# EAGLE design communication (EAGLE 9.6.2)
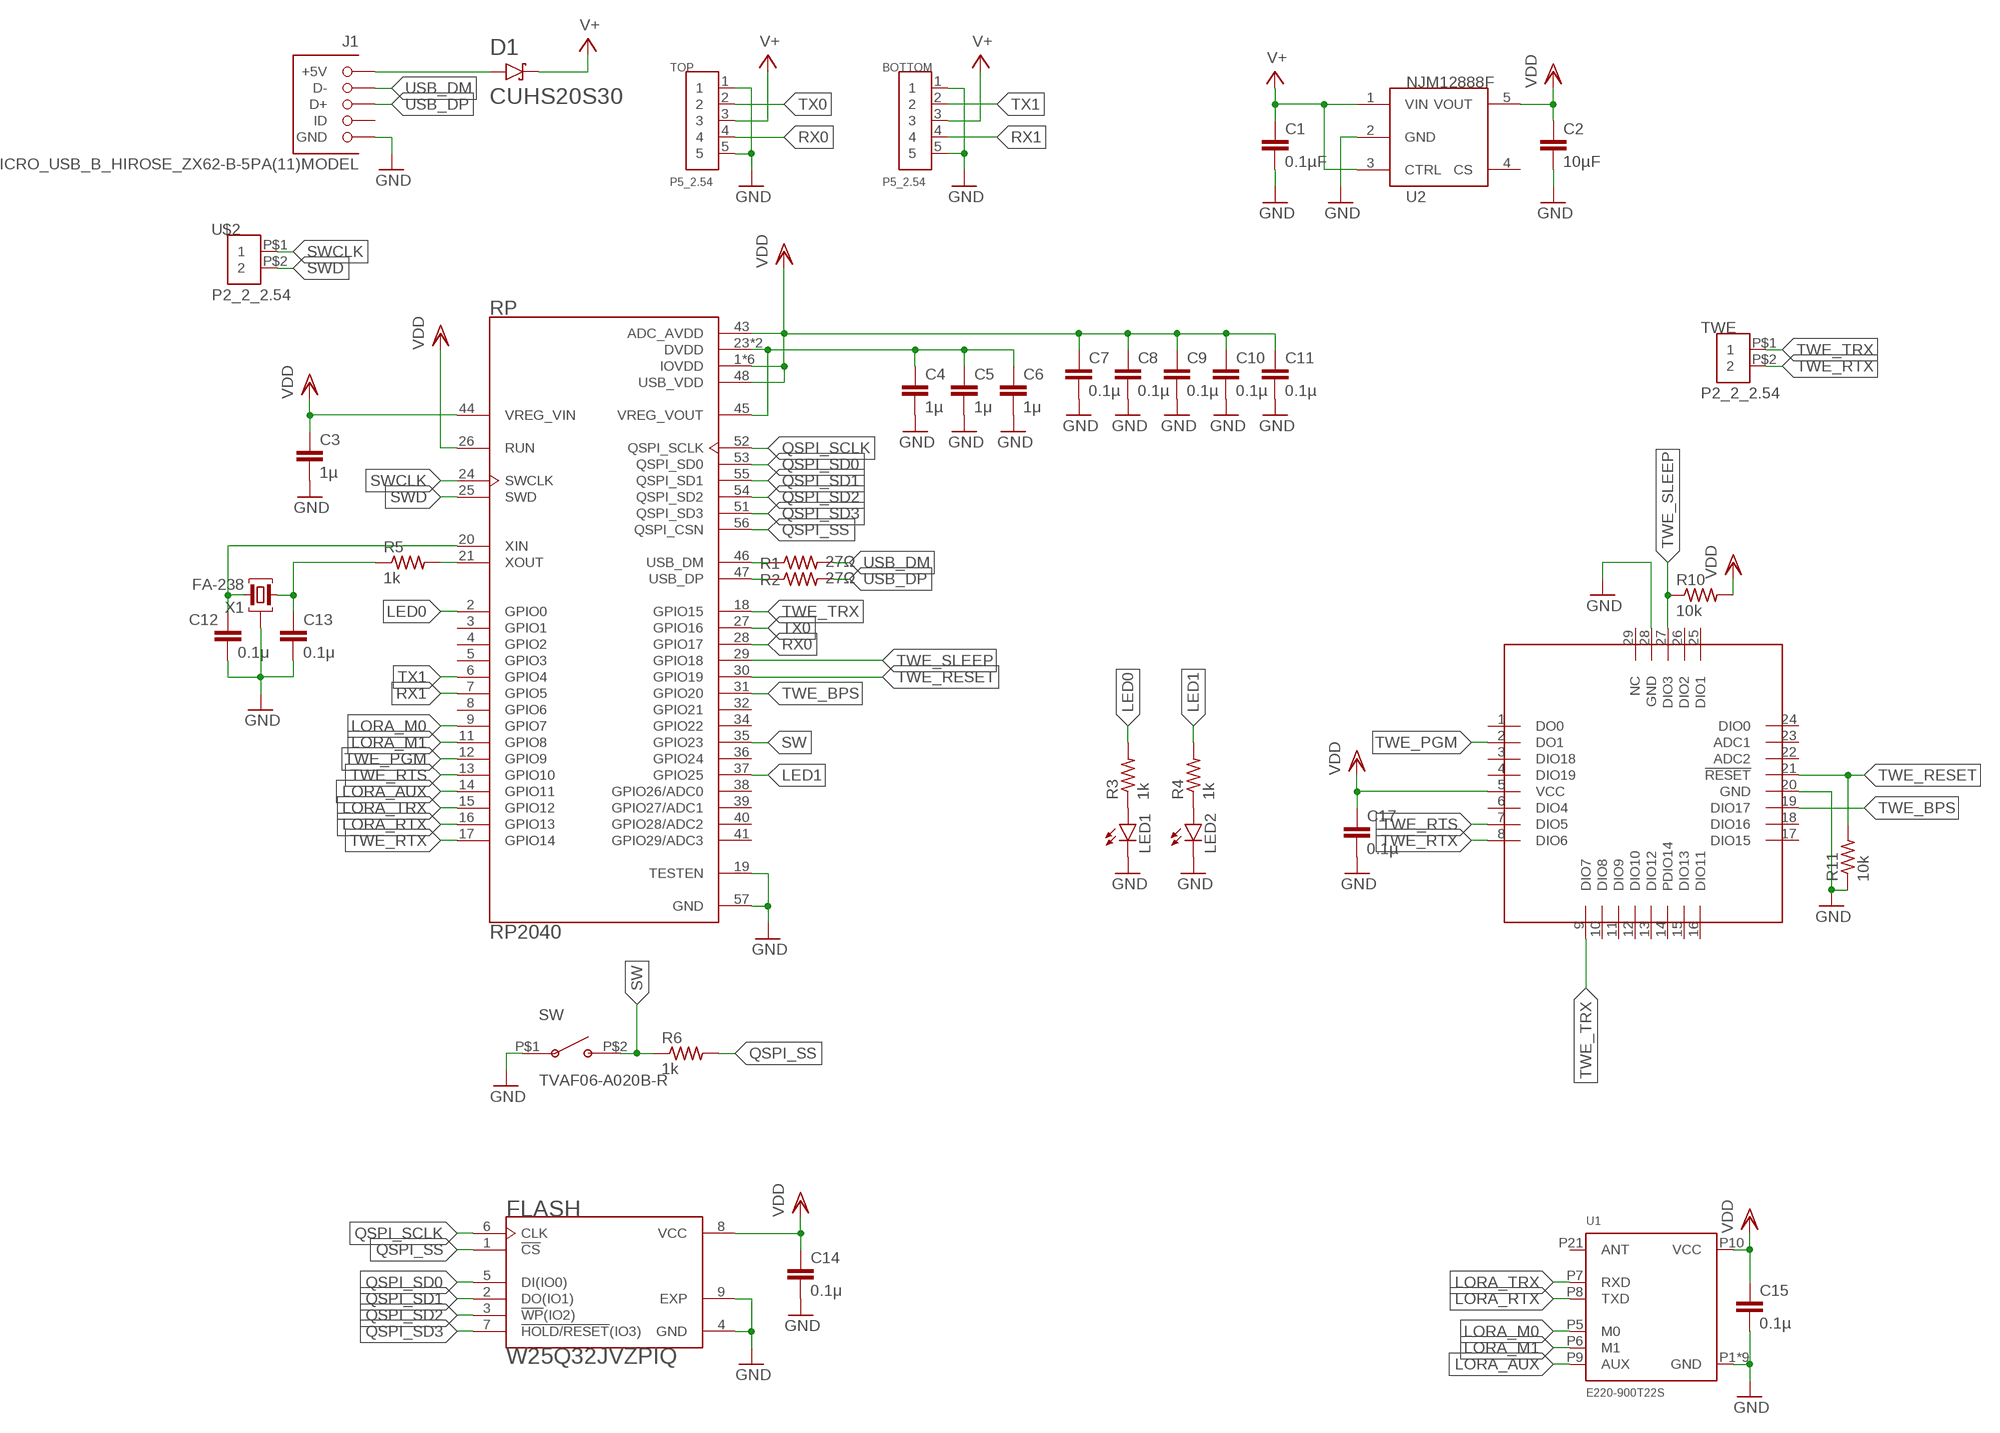
[diagram p0: schematic, sheet 1]

## Parts
BOTTOM  P5_2.54  [P5_2.54]
C1  0.1µF  C-EUC0402  [C0402]
C2  10µF  C-EUC0402  [C0402]
C3  1µ  C-EUC0402  [C0402]
C4  1µ  C-EUC0402  [C0402]
C5  1μ  C-EUC0402  [C0402]
C6  1μ  C-EUC0402  [C0402]
C7  0.1µ  C-EUC0402  [C0402]
C8  0.1µ  C-EUC0402  [C0402]
C9  0.1µ  C-EUC0402  [C0402]
C10  0.1µ  C-EUC0402  [C0402]
C11  0.1µ  C-EUC0402  [C0402]
C12  0.1μ  C-EUC0402  [C0402]
C13  0.1μ  C-EUC0402  [C0402]
C14  0.1μ  C-EUC0402  [C0402]
C15  0.1µ  C-EUC0402  [C0402]
C17  0.1µ  C-EUC0402  [C0402]
D1  CUHS20S30  [CUHS20S30]
FLASH  W25Q32JVZPIQ  [SON127P600X500X80-9N]
J1  MICRO_USB_B_HIROSE_ZX62-B-5PA(11)MODEL  [GHI-CONNECTORS_10118192-0001LF(MICRO-USB-B-AMPHENOL-FCI)]
LED1  LEDCHIPLED_0603  [CHIPLED_0603]
LED2  LEDCHIPLED_0603  [CHIPLED_0603]
R1  27Ω  R-US_R0402  [R0402]
R2  27Ω  R-US_R0402  [R0402]
R3  1k  R-US_R0402  [R0402]
R4  1k  R-US_R0402  [R0402]
R5  1k  R-US_R0402  [R0402]
R6  1k  R-US_R0402  [R0402]
R10  10k  R-US_R0402  [R0402]
R11  10k  R-US_R0402  [R0402]
RP  RP2040  [QFN40P700X700X90-57N]
SW  TVAF06-A020B-R  [TVAF06-A020B-R]
TOP  P5_2.54  [P5_2.54]
TWE  P2_2_2.54  [P2_2.54]
U1  E220-900T22S  [E220-900T22S]
U2  NJM12888F  [SOT95P240X110-5N]
U$1  LITE  [LITE]
U$2  P2_2_2.54  [P2_2.54]
X1  FA-238  [FA-238]

## Nets
1V2: C4.1 C5.1 C6.1 RP.23(DVDD) RP.45(VREG_VOUT) RP.50(DVDD)
GND: BOTTOM.1 BOTTOM.5 C1.2 C2.2 C3.2 C4.2 C5.2 C6.2 C7.2 C8.2 C9.2 C10.2 C11.2 C12.2 C13.2 C14.2 C15.2 C17.2 FLASH.4(GND) FLASH.9(EXP) J1.CGND1(GND) J1.CGND2(GND) J1.CGND3(GND) J1.CGND4(GND) J1.CGND5(GND) J1.CGND6(GND) J1.GND LED1.C LED2.C R11.1 RP.19(TESTEN) RP.57(GND) SW.P$1(A) TOP.1 TOP.5 U1.P1(GND) U1.P2(GND) U1.P3(GND) U1.P4(GND) U1.P11(GND) U1.P13(GND) U1.P19(GND) U1.P20(GND) U1.P22(GND) U2.2(GND) U$1.20(GND) U$1.28(GND) X1.2(G) X1.4(G)
LED0: R3.2 RP.2(GPIO0)
LED1: R4.2 RP.37(GPIO25)
LORA_AUX: RP.14(GPIO11) U1.P9(AUX)
LORA_M0: RP.9(GPIO7) U1.P5(M0)
LORA_M1: RP.11(GPIO8) U1.P6(M1)
LORA_RTX: RP.16(GPIO13) U1.P8(TXD)
LORA_TRX: RP.15(GPIO12) U1.P7(RXD)
N$6: D1.A J1.VBUS(+5V)
N$8: LED1.A R3.1
N$9: LED2.A R4.1
N$11: C13.1 R5.1 X1.1
QSPI_SCLK: FLASH.6(CLK) RP.52(QSPI_SCLK)
QSPI_SD0: FLASH.5(DI(IO0)) RP.53(QSPI_SD0)
QSPI_SD1: FLASH.2(DO(IO1)) RP.55(QSPI_SD1)
QSPI_SD2: FLASH.3(!WP!(IO2)) RP.54(QSPI_SD2)
QSPI_SD3: FLASH.7(!HOLD/RESET!(IO3)) RP.51(QSPI_SD3)
QSPI_SS: FLASH.1(!CS) R6.2 RP.56(QSPI_CSN)
RX0: RP.28(GPIO17) TOP.4
RX1: BOTTOM.4 RP.7(GPIO5)
SW: R6.1 RP.35(GPIO23) SW.P$2(B)
SWCLK: RP.24(SWCLK) U$2.P$1
SWD: RP.25(SWD) U$2.P$2
TWE_BPS: RP.31(GPIO20) U$1.19(DIO17)
TWE_PGM: RP.12(GPIO9) U$1.2(DO1)
TWE_RESET: R11.2 RP.30(GPIO19) U$1.21(!RESET!)
TWE_RTS: RP.13(GPIO10) U$1.7(DIO5)
TWE_RTX: RP.17(GPIO14) TWE.P$2 U$1.8(DIO6)
TWE_SLEEP: R10.1 RP.29(GPIO18) U$1.27(DIO3)
TWE_TRX: RP.18(GPIO15) TWE.P$1 U$1.9(DIO7)
TX0: RP.27(GPIO16) TOP.2
TX1: BOTTOM.2 RP.6(GPIO4)
USB_DM: J1.D- R1.2
USB_DM_1: R1.1 RP.46(USB_DM)
USB_DP: J1.D+ R2.2
USB_DP_1: R2.1 RP.47(USB_DP)
V+: BOTTOM.3 C1.1 D1.C TOP.3 U2.1(VIN) U2.3(CTRL)
VDD: C2.1 C3.1 C7.1 C8.1 C9.1 C10.1 C11.1 C14.1 C15.1 C17.1 FLASH.8(VCC) R10.2 RP.1(IOVDD) RP.10(IOVDD) RP.22(IOVDD) RP.26(RUN) RP.33(IOVDD) RP.42(IOVDD) RP.43(ADC_AVDD) RP.44(VREG_VIN) RP.48(USB_VDD) RP.49(IOVDD) U1.P10(VCC) U2.5(VOUT) U$1.5(VCC)
XIN1: C12.1 RP.20(XIN) X1.3
XOUT1: R5.2 RP.21(XOUT)
Unconnected: J1.ID RP.3(GPIO1) RP.4(GPIO2) RP.5(GPIO3) RP.8(GPIO6) RP.32(GPIO21) RP.34(GPIO22) RP.36(GPIO24) RP.38(GPIO26/ADC0) RP.39(GPIO27/ADC1) RP.40(GPIO28/ADC2) RP.41(GPIO29/ADC3) U1.P21(ANT) U2.4(CS) U$1.1(DO0) U$1.3(DIO18) U$1.4(DIO19) U$1.6(DIO4) U$1.10(DIO8) U$1.11(DIO9) U$1.12(DIO10) U$1.13(DIO12) U$1.14(PDIO14) U$1.15(DIO13) U$1.16(DIO11) U$1.17(DIO15) U$1.18(DIO16) U$1.22(ADC2) U$1.23(ADC1) U$1.24(DIO0) U$1.25(DIO1) U$1.26(DIO2) U$1.29(NC)

## Library data of the parts
BOTTOM TOP = pins:P5_2.54
C1-C15 C17 = rcl:C-EU: CAPACITOR, European symbol; SPICEPREFIX: C
D1 = diodes:CUHS20S30
FLASH = W25Q32JVZPIQ:W25Q32JVZPIQ: Serial Flash Memory With Dual, Quad Spi Check availability <https://pricing.snapeda.com/parts/W25Q32JVZPIQ/Winbond/view-part?ref=eda>; AVAILABILITY: In Stock; DESCRIPTION: FLASH - NOR Memory IC 32Mb (4M x 8) SPI - Quad I/O 133 MHz 8-WSON (6x5); MF: Winbond; MP: W25Q32JVZPIQ; PACKAGE: WSON-8 Winbond; PRICE: None; PURCHASE-URL: https://pricing.snapeda.com/search/part/W25Q32JVZPIQ/?ref=eda
J1 = connector:MICRO_USB_B_HIROSE_ZX62-B-5PA(11): Connector Receptacle USB - micro B 2.0 5 Position Surface Mount, Right Angle, Horizontal Bottom Mount
LED1 LED2 = led:LED: LED OSRAM: - CHIPLED LG R971, LG N971, LY N971, LG Q971, LY Q971, LO R971, LY R971 LH N974, LH R974 LS Q976, LO Q976, LY Q976 LO Q996 - Hyper CHIPLED LW Q18S LB Q993, LB Q99A, LB R99A - SideLED LS A670, LO A670, LY A670, LG A670, LP A670 LB A673, LV A673, LT A673, LW A673 LH A674 LY A675 LS A676, LA A676, LO A676, LY A676, LW A676 LS A679, LY A679, LG A679 - Hyper Micro SIDELED® LS Y876, LA Y876, LO Y876, LY Y876 LT Y87S - SmartLED LW L88C, LW L88S LB L89C, LB L89S, LG L890 LS L89K, LO L89K, LY L89K LS L896, LA L896, LO L896, LY L896 - TOPLED LS T670, LO T670, LY T670, LG T670, LP T670 LSG T670, LSP T670, LSY T670, LOP T670, LYG T670 LG T671, LOG T671, LSG T671 LB T673, LV T673, LT T673, LW T673 LH T674 LS T676, LA T676, LO T676, LY T676, LB T676, LH T676, LSB T676, LW T676 LB T67C, LV T67C, LT T67C, LS T67K, LO T67K, LY T67K, LW E67C LS E67B, LA E67B, LO E67B, LY E67B, LB E67C, LV E67C, LT E67C LW T67C LS T679, LY T679, LG T679 LS T770, LO T770, LY T770, LG T770, LP T770 LB T773, LV T773, LT T773, LW T773 LH T774 LS E675, LA E675, LY E675, LS T675 LS T776, LA T776, LO T776, LY T776, LB T776 LHGB T686 LT T68C, LB T68C - Hyper Mini TOPLED® LB M676 - Mini TOPLED Santana® LG M470 LS M47K, LO M47K, LY M47K Source: http://www.osram.convergy.de LUXEON: - LUMILED® LXK2-PW12-R00, LXK2-PW12-S00, LXK2-PW14-U00, LXK2-PW14-V00 LXK2-PM12-R00, LXK2-PM12-S00, LXK2-PM14-U00 LXK2-PE12-Q00, LXK2-PE12-R00, LXK2-PE12-S00, LXK2-PE14-T00, LXK2-PE14-U00 LXK2-PB12-K00, LXK2-PB12-L00, LXK2-PB12-M00, LXK2-PB14-N00, LXK2-PB14-P00, LXK2-PB14-Q00 LXK2-PR12-L00, LXK2-PR12-M00, LXK2-PR14-Q00, LXK2-PR14-R00 LXK2-PD12-Q00, LXK2-PD12-R00, LXK2-PD12-S00 LXK2-PH12-R00, LXK2-PH12-S00 LXK2-PL12-P00, LXK2-PL12-Q00, LXK2-PL12-R00 Source: www.luxeon.com KINGBRIGHT: KA-3528ASYC Source: www.kingbright.com
R1-R6 R10 R11 = rcl:R-US_: RESISTOR, American symbol; SPICEPREFIX: R
RP = RP2040:RP2040: Check availability <https://pricing.snapeda.com/parts/RP2040/Raspberry%20Pi/view-part?ref=eda>; AVAILABILITY: In Stock; DESCRIPTION: RP2040 chip for Raspberry Pi Pico - ARM® Cortex®-M0+ MCU 32-Bit; MF: Raspberry Pi; MP: RP2040; PACKAGE: None; PRICE: None; PURCHASE-URL: https://pricing.snapeda.com/search/part/RP2040/?ref=eda
SW = switches:TVAF06-A020B-R
TWE U$2 = pins:P2_2_2.54
U1 = lora:E220-900T22S
U2 = regulators:NJM12888F
U$1 = TWELite:LITE
X1 = crystal':FA-238: CRYSTAL

## Board
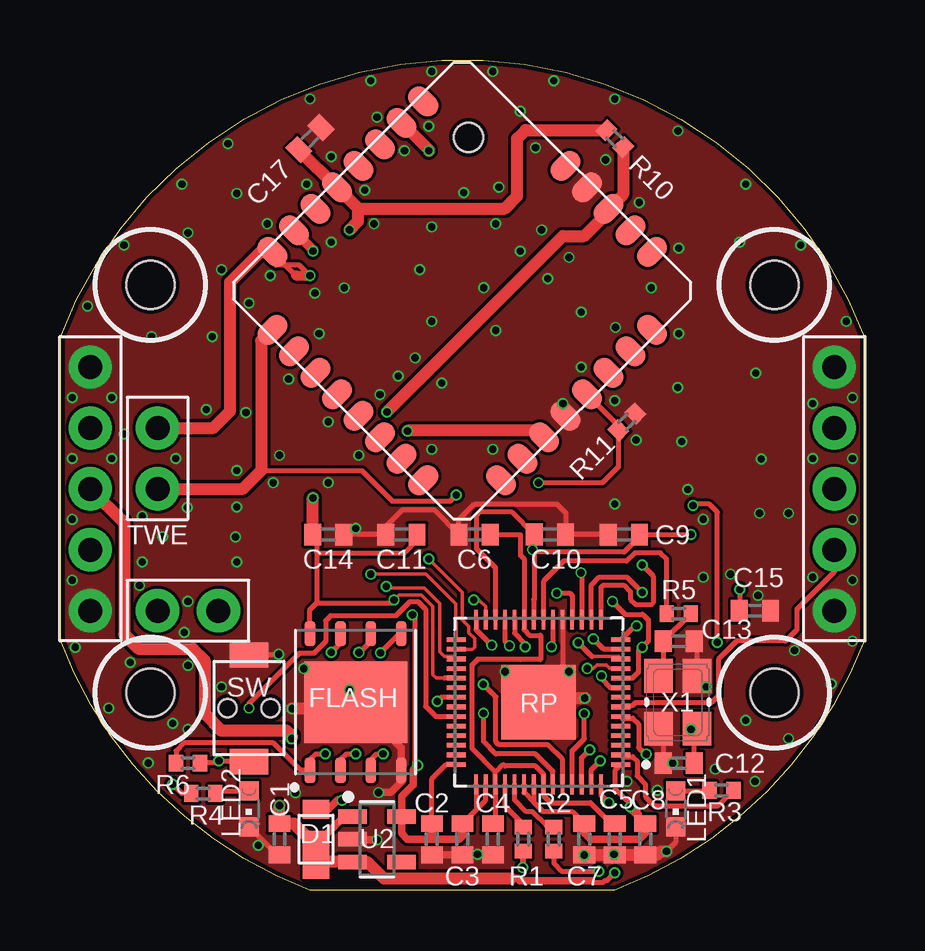
[diagram p1: board, top side]
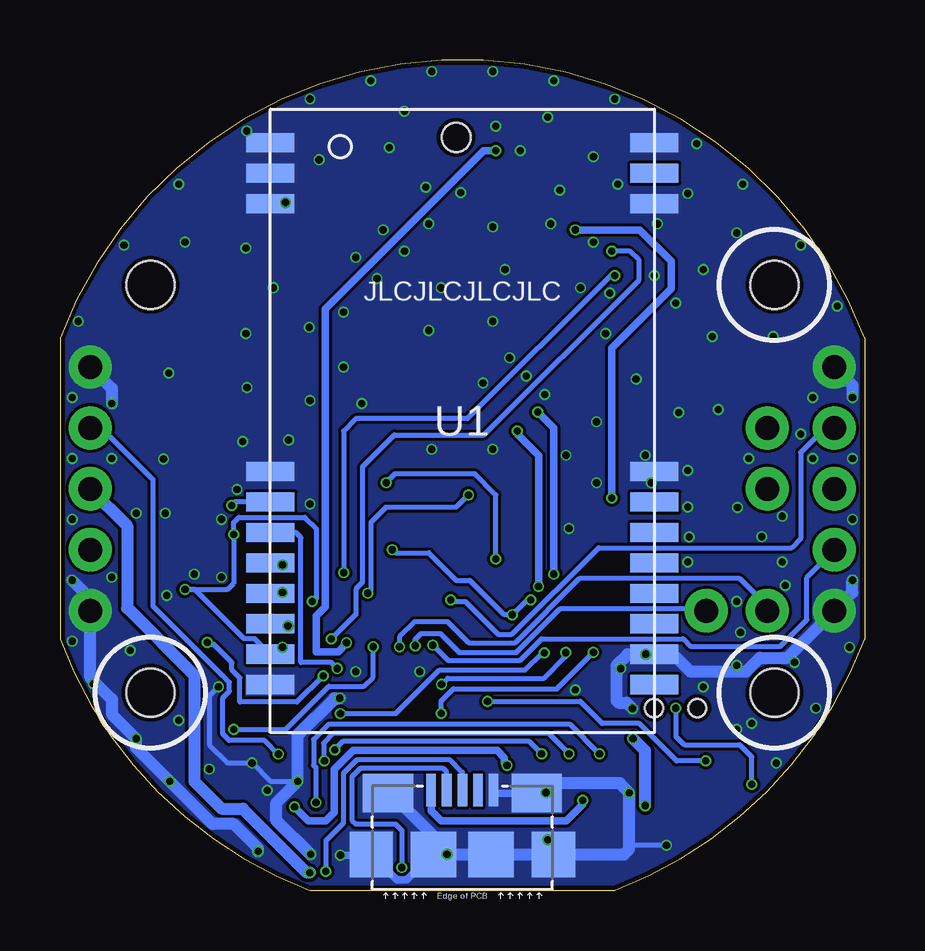
[diagram p2: board, bottom side, seen from below]

Size 33.53 x 34.61 mm. Coordinates in mm from the lower left corner, seen from the top.
Outline: 33.53,23.01 33.53,10.46 arc-49 23.11,0 10.41,0 arc-49 0,10.46 0,23.01 arc-139 33.53,23.01
Copper layers (1*16): Top 0.035mm / dielectric 1mm / Bottom 0.035mm
Design rules "jlcpcb-2layers-1.0mm": minimum track width 5mil, minimum drill 0.3mm, track to track 5mil, track to pad 5mil, pad to pad 5mil, via to via 5mil, smd to smd 5mil, copper to edge 0.2mm, drill to drill 6mil, minimum pad ring 10mil, minimum via ring 3mil, stop-mask expansion 4mil, vias tented up to drill 1mm, thermal gap 10mil
Holes 2 mm at 29.76,25.24 29.76,8.24 3.76,25.24 3.76,8.24

### Footprints (pad centres in the part's own frame; a part is rotated, then mirrored left to right if it is on the bottom)
P5_2.54 = drill 1: 1 0,5.08; 2 0,2.54; 3 0,0; 4 0,-2.54; 5 0,-5.08
C0402 = smd 0.7 x 0.9: 1 -0.65,0; 2 0.65,0
CUHS20S30 = smd 0.8 x 1.1: A 1.25,0 | smd 2 x 1.1: C -0.65,0
SON127P600X500X80-9N = smd 1.04 x 0.44: 1 -2.845,1.905; 2 -2.845,0.635; 3 -2.845,-0.635; 4 -2.845,-1.905; 5 2.845,-1.905; 6 2.845,-0.635; 7 2.845,0.635; 8 2.845,1.905 | smd 3.4 x 4.3: 9 0,0
GHI-CONNECTORS_10118192-0001LF(MICRO-USB-B-AMPHENOL-FCI) = smd 1.8 x 1.9: CGND1 -3.8,0; CGND4 3.8,0 | smd 1.9 x 1.9: CGND2 -1.2,0; CGND3 1.2,0 | smd 2.1 x 1.6: CGND5 3.1,2.55; CGND6 -3.1,2.55 | smd 0.4 x 1.35: D+ 0,2.675; D- -0.65,2.675; GND 1.3,2.675; ID 0.65,2.675; VBUS -1.3,2.675
CHIPLED_0603 = smd 0.8 x 0.8: A 0,-0.75; C 0,0.75
R0402 = smd 0.6 x 0.7: 1 -0.5,0; 2 0.5,0
QFN40P700X700X90-57N = smd 0.84 x 0.2: 1 -3.435,2.6; 2 -3.435,2.2; 3 -3.435,1.8; 4 -3.435,1.4; 5 -3.435,1; 6 -3.435,0.6; 7 -3.435,0.2; 8 -3.435,-0.2; 9 -3.435,-0.6; 10 -3.435,-1; 11 -3.435,-1.4; 12 -3.435,-1.8; 13 -3.435,-2.2; 14 -3.435,-2.6; 29 3.435,-2.6; 30 3.435,-2.2; 31 3.435,-1.8; 32 3.435,-1.4; 33 3.435,-1; 34 3.435,-0.6; 35 3.435,-0.2; 36 3.435,0.2; 37 3.435,0.6; 38 3.435,1; 39 3.435,1.4; 40 3.435,1.8; 41 3.435,2.2; 42 3.435,2.6 | smd 0.2 x 0.84: 15 -2.6,-3.435; 16 -2.2,-3.435; 17 -1.8,-3.435; 18 -1.4,-3.435; 19 -1,-3.435; 20 -0.6,-3.435; 21 -0.2,-3.435; 22 0.2,-3.435; 23 0.6,-3.435; 24 1,-3.435; 25 1.4,-3.435; 26 1.8,-3.435; 27 2.2,-3.435; 28 2.6,-3.435; 43 2.6,3.435; 44 2.2,3.435; 45 1.8,3.435; 46 1.4,3.435; 47 1,3.435; 48 0.6,3.435; 49 0.2,3.435; 50 -0.2,3.435; 51 -0.6,3.435; 52 -1,3.435; 53 -1.4,3.435; 54 -1.8,3.435; 55 -2.2,3.435; 56 -2.6,3.435 | smd 3.1 x 3.1: 57 0,0
TVAF06-A020B-R = smd 1.6 x 1.05: P$1 0,2.225; P$2 0,-2.225 | hole 0.75: -0.9,0; 0.9,0
P2_2.54 = drill 1: P$1 0,1.27; P$2 0,-1.27
E220-900T22S = smd 2 x 0.8: P1 8,-11.6; P2 8,-10.33; P3 8,-9.06; P4 8,2.11; P5 8,3.38; P6 8,4.65; P7 8,5.92; P8 8,7.19; P9 8,8.46; P10 8,9.73; P11 8,11; P12 -8,11; P13 -8,9.73; P14 -8,8.46; P15 -8,7.19; P16 -8,5.92; P17 -8,4.65; P18 -8,3.38; P19 -8,2.11; P20 -8,-9.06; P21 -8,-10.33; P22 -8,-11.6
SOT95P240X110-5N = smd 1.18 x 0.609: 1 -1.024,0.95; 2 -1.024,0; 3 -1.024,-0.95; 4 1.024,-0.95; 5 1.024,0.95
LITE = smd 1.4 x 0.9: 1 0.25,11.43; 2 0.25,10.16; 3 0.25,8.89; 4 0.25,7.62; 5 0.25,6.35; 6 0.25,5.08; 7 0.25,3.81; 8 0.25,2.54; 17 13.72,2.54; 18 13.72,3.81; 19 13.72,5.08; 20 13.72,6.35; 21 13.72,7.62; 22 13.72,8.89; 23 13.72,10.16; 24 13.72,11.43 | smd 0.9 x 1.4: 9 2.54,0.25; 10 3.81,0.25; 11 5.08,0.25; 12 6.35,0.25; 13 7.62,0.25; 14 8.89,0.25; 15 10.16,0.25; 16 11.43,0.25; 25 11.43,13.72; 26 10.16,13.72; 27 8.89,13.72; 28 7.62,13.72; 29 6.35,13.72 | hole 1.2: 2.65,11.7
FA-238 = smd 1.4 x 1.2: 1 -1.1,-0.8; 2 1.1,-0.8; 3 1.1,0.8; 4 -1.1,0.8

### Placement (x,y rotation side)
BOTTOM  32.26,16.74 0 top
C1  9.14,2.13 270 top
C2  15.49,2.13 270 top
C3  16.76,2.13 270 top
C4  18.03,2.13 270 top
C5  23.11,2.13 270 top
C6  17.27,14.83 180 top
C7  21.84,2.13 270 top
C8  24.38,2.13 270 top
C9  23.49,14.83 180 top
C10  20.42,14.83 0 top
C11  14.22,14.83 180 top
C12  25.78,5.31 180 top
C13  25.78,10.39 0 top
C14  11.18,14.83 0 top
C15  28.96,11.66 0 top
C17  10.41,31.34 45 top
D1  10.67,2.13 90 top
FLASH  12.32,7.85 90 top
J1  16.76,1.5 0 bottom
LED1  25.65,3.4 180 top
LED2  7.87,3.4 180 top
R1  19.3,2.13 270 top
R2  20.57,2.13 270 top
R3  27.56,4.16 0 top
R4  5.97,4.04 180 top
R5  25.78,11.53 180 top
R6  5.33,5.31 180 top
R10  23.11,31.34 135 top
R11  23.62,19.53 225 top
RP  19.94,7.85 180 top
SW  7.87,7.59 0 top
TOP  1.26,16.74 0 top
TWE  4.06,18.01 180 top
U1  16.76,19.57 180 bottom
U2  13.21,2.13 0 top
U$1  6.88,24.99 315 top
U$2  5.33,11.66 90 top
X1  25.74,7.84 270 top

### Tracks (layer width: path | path; a pad name or v marks a point on that pad's centre or on a via)
1V2
  Top 0.2: C4.1 18.14,2.89 RP.45 18.14,4.9 18.16,4.92 | C5.1 22.97,2.78 22.1,3.65 20.45,3.65 20.14,3.96 RP.50 20.14,4.85 19.81,5.18 18.54,5.18 18.48,5.24 18.16,4.92 | 18.16,4.92 17.18,5.91 17.18,9.4 17.4,9.63 19.18,9.63 19.18,9.62 20.03,9.62 20.03,10.63 19.56,10.63 19.34,10.85 RP.23 19.34,13.82 19.18,13.98 19.18,14.83 C6.1
GND  (via drill 0.3)
  Top 0.2: 21.04,14.8 C10.2 | C10.2 21.18,14.83 | RP.19 20.94,8.85 RP.57 | SW.P$1 7.89,9.84 v9.12,9.84 | LED2.C 8.39,2.14 | 8.39,2.14 9.04,1.48 C1.2 | LED1.C 25.65,2 v25.27,1.62 | X1.2 25.13,6.55 C12.2 v25.53,5.31 | C13.2 26.54,10.28 X1.4 26.67,8.81 26.67,8.73 v26.92,8.48 | C10.2 C9.2 | C14.2 C11.2 13.57,15.16 14.26,15.85 15.61,15.85 C6.2 16.62,15.45 17.27,16.1 20.7,16.1 21.06,15.74 C10.2 | v8.25,1.88 8.39,2.01 8.39,2.14
  Top 0.305: FLASH.9 14.22,5.94 FLASH.4 14.22,4.51 13.79,4.07 v13.27,4.07 | v13.21,2.1 12.21,2.1 U2.2 | C7.2 v21.84,1.46 | C4.2 C3.2 C2.2
  Top 0.508: v9.67,7.57 12.04,7.57 FLASH.9 | C7.2 C5.2 C8.2 24.89,1.48 25.04,1.62 v25.27,1.62 | v21.87,8.01 v21.86,8.01 20.1,8.01 RP.57
  Bottom 0.2: J1.CGND2 17.65,1.5 | v23.62,4.54 24.77,4.54 v25.53,5.31 26.54,5.31 27.3,6.07 27.3,8.1 v26.92,8.48 | v8.25,1.88 9.68,1.88 9.81,2
  Bottom 0.305: J1.CGND4 13.21,1.74 v13.21,2.1 | J1.GND 15.34,4.05 J1.CGND5 | v21.84,1.46 20.59,1.46 J1.CGND1 20.55,1.5 19.5,0.44 19.08,0.44 18.02,1.5
  Bottom 0.508: J1.CGND6 19.75,4.05 17.96,2.26 J1.CGND2 18.02,1.5 | 17.65,1.5 J1.CGND3 J1.CGND4 10.03,1.5 9.81,1.72 9.81,2 v9.81,4.07 10.2,4.46 13.25,4.46 J1.CGND5 | v25.27,1.62 25.27,1.74 26.3,2.77 27.18,2.77 v28.96,4.54 30.35,5.94 v30.35,6.32 31.37,7.34 31.37,7.97 32.26,8.86 BOTTOM.5 32.26,12.17 v33.02,12.93 | v23.08,1.49 v23.09,1.5 23.11,1.5 24.51,2.9 24.51,3.65 v23.62,4.54 23.62,6.47 22.09,8.01 v21.87,8.01 | v9.67,7.57 9.92,7.81 10.25,7.81 10.34,7.91 10.34,9.37 9.88,9.84 v9.12,9.84 9,9.72 7.87,9.72 7.27,9.12 4.94,9.12 4.37,9.69 3.23,9.69 TOP.5 0.51,12.41 v0.51,12.93 | 9.12,9.81 9.09,9.78 | BOTTOM.1 31.37,20.92 v31.37,20.29 | TOP.1 0.51,21.06 v0.51,20.55
  other vias: 33.02,10.39 33.02,20.55 32.77,23.72 30.86,26.9 28.57,29.44 25.75,31.66 23.11,32.99 20.57,33.75 18.03,34.13 15.49,34.13 12.95,33.75 10.41,32.99 7,31.13 2.67,26.9 1.14,24.36 0.51,18.01 0.51,15.47 0.63,10.13 2.03,7.59 3.68,5.31 4.7,6.96 33.02,15.47 33.02,18.01 31.37,18.01 30.35,15.72 31.37,13.05 17.4,1.5 5.33,6.7 6.73,8.48 2.67,19.02 2.92,9.5 3.31,12.71 5.33,9.37 4.29,14.74 2.16,20.55 2.16,18.01 7.31,14.73 5.3,15.96 5.33,12.04 5.17,10.75 15.49,23.72 5.08,29.44 15.49,18.39 18.03,18.39 18.29,29.31 19.81,30.96 22.73,30.45 20.07,27.53 21.21,26.39 25.78,26.77 25.78,23.21 23.14,23.47 20.32,25.5 21.72,24.1 21.72,21.82 20.95,20.29 15.91,21.15 18.16,23.34 14.79,22.2 19.18,26.64 18.16,27.78 13.08,27.78 11.3,27.02 11.84,25.12 10.62,24.89 14.1,21.43 8.76,25.63 10.79,23.21 13.33,20.67 16.83,29.09 12.7,29.18 14.35,30.83 15.37,31.85 19.18,32.48 13.21,32.23 11.3,30.58 10.29,29.44 8.64,27.78 6.73,25.88 7.87,24.48 7.75,19.91 7.37,17.5 4.83,18.01 6.1,20.04 6.35,23.09 3.81,23.09 7.37,29.05 5.33,27.4 15.49,27.66 14.99,25.88 17.65,25.12 11.18,19.53 9.52,21.31 9.14,18.13 12.45,18.13 11.18,16.99 12.32,15.08 8.89,16.99 7.37,15.97 3.43,15.59 3.43,13.69 7.37,13.69 10.16,9.24 12.06,8.35 18.54,9.12 21.21,9.12 28.57,7.08 30.61,10 32.13,8.61 29.08,12.29 26.8,13.05 26.8,15.47 27.94,13.18 29.15,15.72 26.15,16.71 29.21,17.97 28.99,21.56 25.73,20.96 23.11,16.1 24,18.77 23.11,20.42 24.64,25.12 28.32,27.02 24.13,28.67 25.91,18.7 27.3,5.05 24.89,4.16
  pour Top (no thermals): -3.56,37.06 38.35,37.06 38.35,-3.58 -3.56,-3.58
  pour Bottom (no thermals): -7.37,44.68 42.16,44.68 42.16,-6.12 -7.37,-6.12
  pour Bottom: -4.32,40.36 -4.32,-2.06 37.85,-2.06 38.23,-2.44 38.23,39.09 37.97,39.34 -3.94,39.34 -4.19,39.34
LED0
  Top 0.2: RP.2 23.45,5.57 23.87,5.57 24.04,5.4 24.04,4.76 24.39,4.41 24.39,3.9 24.77,3.52 27.42,3.52 R3.2
LED1  (via drill 0.3)
  Top 0.2: RP.37 15.65,7.25 15.23,7.67 15.23,11.71 14.93,12.01 14.57,12.01 13.99,11.44 11.27,11.44 11.07,11.23 11.07,10.37 10.57,9.88 9.97,9.88 7.87,7.78 v7.87,7.59 | R4.2 5.08,4.04 v4.7,4.42
  Bottom 0.2: v4.7,4.42 4.7,5.56 5.21,6.07 7.52,6.07 7.85,6.4 7.85,7.59 v7.87,7.59
LORA_AUX  (via drill 0.3)
  Top 0.2: v24.02,11.02 23.95,11.02 RP.14
  Bottom 0.2: U1.P9 24.67,11.02 v24.02,11.02
LORA_M0  (via drill 0.3)
  Top 0.2: v22.56,8.94 22.56,8.83 22.95,8.45 RP.9 | v27.39,10.33 27.39,15.76 27.05,16.1 26.43,16.1 v26.37,16.05
  Bottom 0.2: v22.56,8.94 23.65,7.85 26.04,7.85 26.04,8.86 26.36,9.19 26.36,9.5 27.12,10.26 27.39,10.26 v27.39,10.33 | U1.P5 26.23,16.19 v26.37,16.05
LORA_M1  (via drill 0.3)
  Top 0.152: v21.97,9.24 22.23,9.24 22.38,9.39 22.75,9.39 22.9,9.25 RP.11
  Bottom 0.2: v21.97,9.24 22.23,9.5 23.49,9.5 23.49,14.7 23.71,14.92 U1.P6
LORA_RTX  (via drill 0.3)
  Top 0.203: RP.16 22.14,12.71 22.48,13.05 23.62,13.05 v24.26,12.42
  Bottom 0.2: U1.P8 24.29,12.38 v24.26,12.42
LORA_TRX  (via drill 0.3)
  Top 0.2: 22.53,12.61 22.54,12.61 22.66,12.72 23.49,12.72 23.77,12.44 23.77,12.13 23.99,11.91 24.64,11.91
  Top 0.203: 22.53,12.61 22.53,11.29 RP.15 | 24.64,11.91 24.74,12.01 24.74,13.08 v24.26,13.56
  Bottom 0.2: U1.P7 24.35,13.65 v24.26,13.56
N$6  (via drill 0.3)
  Top 0.305: D1.A 11.19,3.38 11.58,3.77 11.73,3.77 v11.75,3.75
  Bottom 0.305: J1.VBUS 18.06,3.3 17.65,2.89 12.44,2.89 11.75,3.58 v11.75,3.75
N$8
  Top 0.2: LED1.A 27.05,4.15 R3.1
N$9
  Top 0.2: R4.1 6.58,4.15 LED2.A
N$11
  Top 0.2: R5.1 C13.1 25.13,9.13 X1.1
QSPI_SCLK  (via drill 0.3)
  Top 0.2: RP.52 20.94,5.45 20.32,6.07 18.29,6.07 18.16,6.19 18.16,8.07 18.02,8.21 18.01,8.21 v17.63,8.59 | v12.45,9.91 12.5,9.91 12.95,10.37 FLASH.6
  Bottom 0.2: v17.63,8.59 17.38,8.84 13.35,8.84 12.45,9.74 v12.45,9.91
QSPI_SD0  (via drill 0.3)
  Top 0.2: RP.53 21.34,5.82 21.84,6.32 v21.84,7.37 | FLASH.5 14.14,10.69 v13.35,9.9
  Bottom 0.2: v21.84,7.37 19.53,7.37 17.72,9.18 14.16,9.18 13.44,9.9 v13.35,9.9
QSPI_SD1  (via drill 0.3)
  Top 0.2: RP.55 22.14,5.03 v22.51,5.4 | FLASH.2 11.68,5.43 11.94,5.69 v12.32,5.69
  Bottom 0.2: v22.51,5.4 22.54,5.43 22.54,6.13 22.11,6.56 13.19,6.56 v12.32,5.69
QSPI_SD2  (via drill 0.3)
  Top 0.2: RP.54 21.74,5.52 v22.08,5.86 | FLASH.3 12.95,5.43 13.21,5.69 v13.46,5.69
  Bottom 0.2: v22.08,5.86 v22.08,5.87 21.72,6.22 14,6.22 v13.46,5.69
QSPI_SD3  (via drill 0.3)
  Top 0.2: RP.51 20.54,4.96 19.81,5.69 18.16,5.69 17.65,6.2 v17.65,7.38 | v11.3,9.91 11.68,10.29 FLASH.7
  Bottom 0.2: v17.65,7.38 17.65,7.89 17.14,8.4 12.83,8.4 12.83,8.39 v11.3,9.91
QSPI_SS  (via drill 0.3)
  Top 0.2: RP.56 22.54,3.98 v22.86,3.65 | v11.05,5.69 10.67,5.69 10.41,5.43 FLASH.1 10.03,5 8.89,6.14 5.16,6.14 4.83,5.81 R6.2
  Bottom 0.2: v22.86,3.65 22.86,5.11 22.96,5.21 22.96,6.3 22.36,6.91 12.27,6.91 v11.05,5.69
RX0  (via drill 0.3)
  Top 0.2: v17.99,10.22 17.97,10.22 17.34,10.85 RP.28
  Bottom 0.2: TOP.4 2.41,13.04 2.41,11.27 3.52,10.17 7.26,10.17 7.57,10.48 13.46,10.48 14.38,9.56 17.33,9.56 v17.99,10.22
RX1
  Top 0.2: RP.7 23.45,7.72 23.87,7.72 23.98,7.83 27.15,7.83 27.43,8.11 27.43,9.62 28.19,10.39 30.23,10.39 30.7,10.85 30.7,11.71 32.26,13.27 BOTTOM.4
SW  (via drill 0.3)
  Top 0.2: RP.35 15.87,8.04 v15.72,7.88 | SW.P$2 7.09,5.37 7.06,5.4 v6.62,5.4 6.53,5.31 R6.1
  Bottom 0.2: v15.72,7.88 11.85,7.88 10.93,6.96 9.4,6.96 7.84,5.4 v6.62,5.4
SWCLK  (via drill 0.3)
  Top 0.2: RP.24 18.94,10.72 19.38,10.28 v19.38,10.15
  Bottom 0.2: U$2.P$1 4.06,11.84 5.23,13.01 11.87,13.01 14.57,10.32 16.5,10.32 17.38,11.19 18.75,11.19 19.38,10.56 v19.38,10.15
SWD  (via drill 0.3)
  Top 0.2: RP.25 18.54,10.39 v18.73,10.19
  Bottom 0.2: v18.73,10.19 18.73,10.45 18.48,10.7 17.68,10.7 16.89,9.91 14.51,9.91 12.67,11.74 6.59,11.74 6.6,11.73 U$2.P$2
TWE_BPS  (via drill 0.3)
  Top 0.152: RP.31 16.41,9.74 16.01,9.74 15.81,9.94 15.81,11.96 15.18,12.6 13.66,12.6 v13.59,12.67
  Top 0.508: U$1.19 19.88,19.17 14.5,19.17 v14.48,19.15
  Bottom 0.305: v13.59,12.67 13.59,18.13 14.48,19.02 v14.48,19.15
TWE_PGM  (via drill 0.3)
  Top 0.152: 22.17,9.74 23.28,9.74 RP.12
  Top 0.2: v21.59,10.32 22.17,9.74
  Top 0.508: U$1.2 15.37,30.87 v15.37,30.83
  Bottom 0.305: v21.59,10.32 21.59,10.29 21.94,9.94 22.86,9.94 22.86,11.43 22.48,11.81 22.48,24.23 15.88,30.83 v15.37,30.83
TWE_RESET  (via drill 0.3)
  Top 0.152: RP.30 17.19,10.05 17.27,10.13 17.27,10.49 17.04,10.73 17.04,11 16.76,11.27 16.76,12.42 v15.37,13.81
  Top 0.203: v19.94,16.99 22.61,16.99 23.27,17.65 R11.2 23.27,19.37 U$1.21
  Bottom 0.203: v15.37,13.81 15.37,16.48 16.26,17.37 19.56,17.37 v19.94,16.99
TWE_RTS  (via drill 0.3)
  Top 0.2: RP.13 22.66,10.05 v22.23,10.48
  Top 0.406: U$1.7 10.54,26.71 v10.54,26.64
  Bottom 0.203: v22.23,10.48 21.19,11.51 21.19,12.54 | v10.54,26.64 9.78,26.64 9.4,26.26 9.4,25.44 15.86,18.98 19.6,18.98 20.92,17.66 20.92,12.85 21.18,12.59 21.18,12.56 21.19,12.54 | 21.19,12.54 21.19,12.56
TWE_RTX  (via drill 0.3)
  Top 0.2: 9.83,25.63 U$1.8 9,26.06 9.98,26.06 v10.41,25.63
  Top 0.203: v21.71,13.24 21.74,13.21 RP.17
  Top 0.406: 9.83,25.63 v10.41,25.63
  Top 0.508: TWE.P$2 6.39,19.28 7.08,19.97 7.08,25.34 8.35,26.61 U$1.8
  Bottom 0.203: v10.41,25.63 10.58,25.63 16.55,19.66 21.21,19.66 21.71,19.16 v21.71,13.24
TWE_SLEEP  (via drill 0.3)
  Top 0.152: RP.29 16.5,11.14 16.48,11.16 16.48,11.93 15.24,13.18 v12.95,13.18
  Top 0.508: R10.1 23.47,29.01 U$1.27 22.86,28.3 21.84,27.28 20.95,27.28 v13.62,19.94
  Bottom 0.305: v13.62,19.94 12.95,19.28 v12.95,13.18
TWE_TRX  (via drill 0.3)
  Top 0.203: 8.38,17.5 12.57,17.5 13.84,16.23 16.26,16.23 v16.51,16.48 | v20.7,12.39 21.24,12.39 21.34,12.29 RP.18
  Top 0.508: TWE.P$1 7.62,16.74 8.38,17.5 8.38,22.9 U$1.9
  Bottom 0.203: v16.51,16.48 17.02,15.97 19.94,15.97 20.57,15.34 20.57,12.52 v20.7,12.39
TX0  (via drill 0.3)
  Top 0.152: RP.27 17.74,11.82 17.46,12.11 v17.24,12.11
  Bottom 0.152: v17.24,12.11 17.24,12.04
  Bottom 0.2: TOP.2 1.65,19.28 2.67,18.26 2.67,14.66 3.05,14.28 11.09,14.28 14.7,10.67 15.27,10.67 16.63,12.04 17.24,12.04
TX1  (via drill 0.3)
  Top 0.2: RP.6 23.45,7.17 23.87,7.17 24.11,6.93 24.11,5.94 24.25,5.81 24.31,5.81 v24.43,5.68
  Bottom 0.2: BOTTOM.2 31.81,19.28 29.65,17.11 29.65,11.84 26.74,8.93 26.47,8.67 26.47,8.29 26.74,8.02 26.74,6.51 26.48,6.25 25,6.25 v24.43,5.68
USB_DM  (via drill 0.3)
  Top 0.254: R1.2 19.29,1.61 v19.29,0.95
  Bottom 0.2: J1.D- 17.41,4.94 17.55,5.08 21.02,5.08 21.37,4.74 21.37,2.93 21.21,2.77 19.56,2.77 19.29,2.49 v19.29,0.95
USB_DM_1
  Top 0.2: RP.46 18.54,3.52 19.3,2.76 R1.1
USB_DP  (via drill 0.3)
  Top 0.2: v22.45,0.8 20.89,0.8 20.57,1.11 R2.2
  Bottom 0.2: J1.D+ 16.76,4.92 17.27,5.43 21.17,5.43 21.72,4.88 21.72,2.8 22.45,2.07 v22.45,0.8
USB_DP_1
  Top 0.2: R2.1 20.51,2.7 20.25,2.7 19.68,3.27 19.43,3.27 18.94,3.77 RP.47
V+  (via drill 0.3)
  Top 0.2: v23.12,0.73 22.8,0.42 22.71,0.42 22.64,0.34 22.2,0.34 22.16,0.39 22.15,0.39
  Top 0.305: D1.C 10.78,1.59 10.78,2.02 11.84,3.08 U2.1 | 18.8,0.49 19.06,0.49 19.17,0.39 22.15,0.39
  Top 0.508: 18.8,0.49 13.49,0.49 12.8,1.18 U2.3 10.97,1.18 D1.C 10.67,1.86 9.75,2.78 C1.1 v9.14,3.53 | TOP.3 2.67,15.33 2.67,10.67 3.27,10.07 5.54,10.07 6.02,9.59 6.02,7.35 6.72,6.65 9.45,6.65 9.65,6.45 v9.65,6.32
  Bottom 0.508: v23.12,0.73 23.24,0.73 25.91,3.4 26.8,3.4 27.93,4.53 27.93,8.96 30.73,11.77 30.73,15.21 BOTTOM.3 | v9.14,3.53 9.14,5.81 v9.65,6.32
VDD  (via drill 0.3)
  Top 0.152: 16.02,8.85 15.68,8.85 15.54,8.99 15.54,11.84 15.06,12.32 14.13,12.32 v13.91,12.1
  Top 0.2: RP.44 17.74,3.76 17.34,3.36 | 17.34,3.36 C3.1 | RP.42 16.1,5.25 15.49,4.64 C2.1 | RP.48 19.34,4.07 19.74,3.67 | 19.74,3.67 20.12,3.29 21.34,3.29 C7.1 | RP.33 16.02,8.85 | RP.43 17.34,3.36 | 10.41,14.72 C14.1 10.53,14.59 10.69,14.42 10.69,14.07 | 19.71,14.77 C10.1 | RP.1 23.12,4.99 23.12,4.23 24.13,3.22 24.13,3.03 C8.1 | C9.1 24.13,14.82 | RP.10 23.86,8.85 24.11,9.1 24.11,9.99 v24.26,10.13 | C11.1 14.87,14.58 14.37,14.07 10.69,14.07 | v14.9,5.21 14.78,5.33 14.78,11.37 v14.68,11.49 | RP.49 19.74,3.67 | FLASH.8 10.41,11.69 10.69,11.97 | 10.69,14.07 10.69,11.97 | 10.69,11.97 13.79,11.97 v13.91,12.1 | RP.22 19.74,12.11 19.77,12.14 C10.1 | RP.26 18.14,13.46 17.34,14.25 17.34,15.63 17.48,15.76 18.84,15.76 C10.1 | C9.1 v26.29,14.83 | C9.1 24.14,14.74 23.51,14.1 19.78,14.1 v19.68,14.2 19.77,14.28 C10.1 | v28.32,12.54 28.32,11.67 C15.1
  Top 0.203: v23.02,12.04 23.55,11.51 24.28,11.51 24.51,11.27 24.51,10.39 v24.26,10.13
  Top 0.305: C3.1 16.76,2.26 16.64,2.13 15.49,2.13 | C2.1 15.49,2.13 | C7.1 21.85,2.39 22.11,2.13 24.13,2.13 24.38,2.38 C8.1 23.76,3.41 v23.76,3.47 | 15.49,2.13 14.48,2.13 14.23,2.38 U2.5 14.23,3.91 14.72,4.4 14.72,5.02 v14.9,5.21
  Top 0.508: C17.1 11.53,29.3 U$1.5 12.43,28.42 | R10.2 19.4,31.69 19.05,31.34 19.05,28.93 18.54,28.42 12.43,28.42 | v12.06,27.53 12.43,27.89 12.43,28.42 | C14.1 10.54,14.85 v10.54,16.35
  Bottom 0.2: v13.91,12.1 14.05,12.1 v14.68,11.49 15.02,11.49 16.46,12.93 17.02,12.93 18.16,14.07 19.56,14.07 v19.68,14.2 | v23.02,12.04 22.95,12.04 22.86,12.13 22.86,15.08 23.32,15.55 26.08,15.55 26.29,15.34 v26.29,14.83 26.29,12.8 26.54,12.54 v28.32,12.54 27.92,12.54 25.86,10.48 25.41,10.48 U1.P10 24.55,9.84 v24.26,10.13
  Bottom 0.305: v14.9,5.21 15.01,5.32 15.01,5.53 15.31,5.83 21.31,5.83 22.1,5.04 22.1,4.67 22.1,3.26 22.46,2.89 23.18,2.89 v23.76,3.47 | v12.06,27.53 9.37,27.53 8.07,26.23 8.07,25.09 10.54,22.61 v10.54,16.35
XIN1  (via drill 0.3)
  Top 0.2: v20.48,10.15 20.54,10.21 RP.20 | C12.1 26.43,6.63 X1.3 26.51,6.7 v26.29,6.7
  Bottom 0.2: v20.48,10.15 20.48,8.88 20.86,8.5 22.32,8.5 24.12,6.7 v26.29,6.7
XOUT1
  Top 0.2: RP.21 20.14,12.87 20.99,13.72 23.61,13.72 23.96,14.07 25.02,14.07 25.28,13.81 R5.2

### Text on the board
bNames: JLCJLCJLCJLC
tStop: 2023 / WASA / Rocket
bStop: TERES / Comm Module